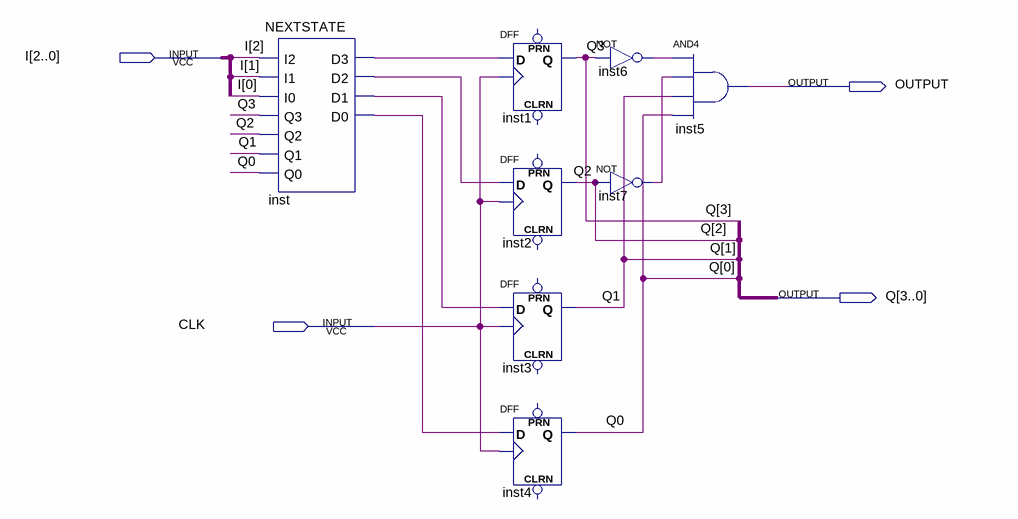
[diagram p0: schematic sheet]
// Quartus schematic MOORE_MSSV.bdf as structural Verilog: 8 symbols, 4 pins
module MOORE_MSSV (
  input  [2:0] I,
  input  CLK,
  output OUTPUT,
  output [3:0] Q
);

  wire inst6_out, inst7_out, inst_d0, inst_d1, inst_d2, inst_d3;

  NEXTSTATE inst (
    .I2(I[2]), .I1(I[1]), .I0(I[0]), .Q3(Q[3]), .Q2(Q[2]), .Q1(Q[1]), .Q0(Q[0]), .D3(inst_d3), .D1(inst_d1),
    .D2(inst_d2), .D0(inst_d0));
  DFF inst1 (.CLK(CLK), .D(inst_d3), .Q(Q[3]));  // open: CLRN, PRN
  DFF inst2 (.CLK(CLK), .D(inst_d2), .Q(Q[2]));  // open: CLRN, PRN
  DFF inst3 (.CLK(CLK), .D(inst_d1), .Q(Q[1]));  // open: CLRN, PRN
  DFF inst4 (.CLK(CLK), .D(inst_d0), .Q(Q[0]));  // open: CLRN, PRN
  not inst6 (inst6_out, Q[3]);
  not inst7 (inst7_out, Q[2]);
  and inst5 (OUTPUT, inst6_out, inst7_out, Q[1], Q[0]);
endmodule
